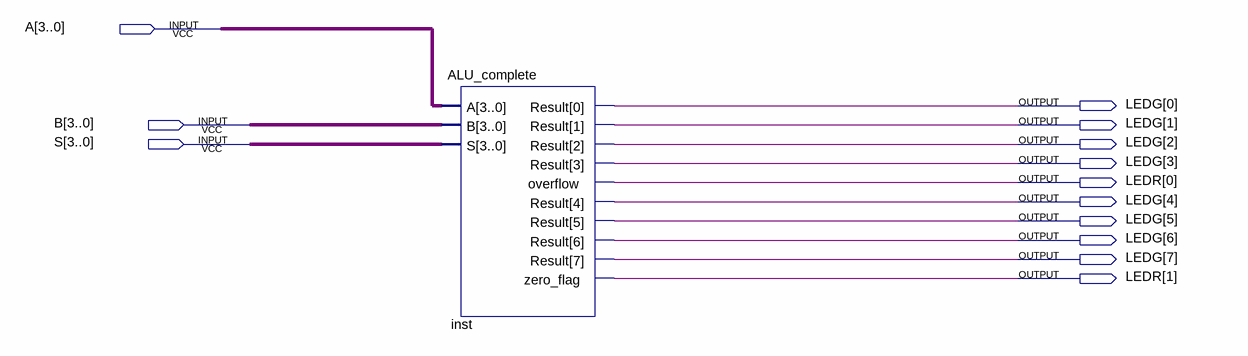
[diagram p0: schematic sheet]
// Quartus schematic Lab3.bdf as structural Verilog: 1 symbols, 13 pins
module Lab3 (
  input  [3:0] A,
  input  [3:0] B,
  input  [3:0] S,
  output [7:0] LEDG,
  output [1:0] LEDR
);

  ALU_complete inst (.A(A), .B(B), .S(S), .Result(LEDG), .overflow(LEDR[0]), .zero_flag(LEDR[1]));
endmodule
